# Altium schematic sheet STlink_V3E_Module.SchDoc: ST-LINK/V3E-SWD Module
size A4; Date: Not used; ApprovedBy: Not used; CheckedBy: Not used; Author: Not used; CompanyName: STMicroelectronics; DrawnBy: Not used; Engineer: Not used; Organization: Not used; Address1: Not used; Address2: Not used; Address3: Not used; Address4: Not used; DocumentNumber: Not used; Revision: Not used; SheetNumber: 17; SheetTotal: 19; CurrentTime: Not used; CurrentDate: Not used; Time: Not used; DocumentFullPathAndName: Not used; DocumentName: Not used; ModifiedDate: Not used; ImagePath: Not used; ProjectName: Not used; Application_BuildNumber: Not used
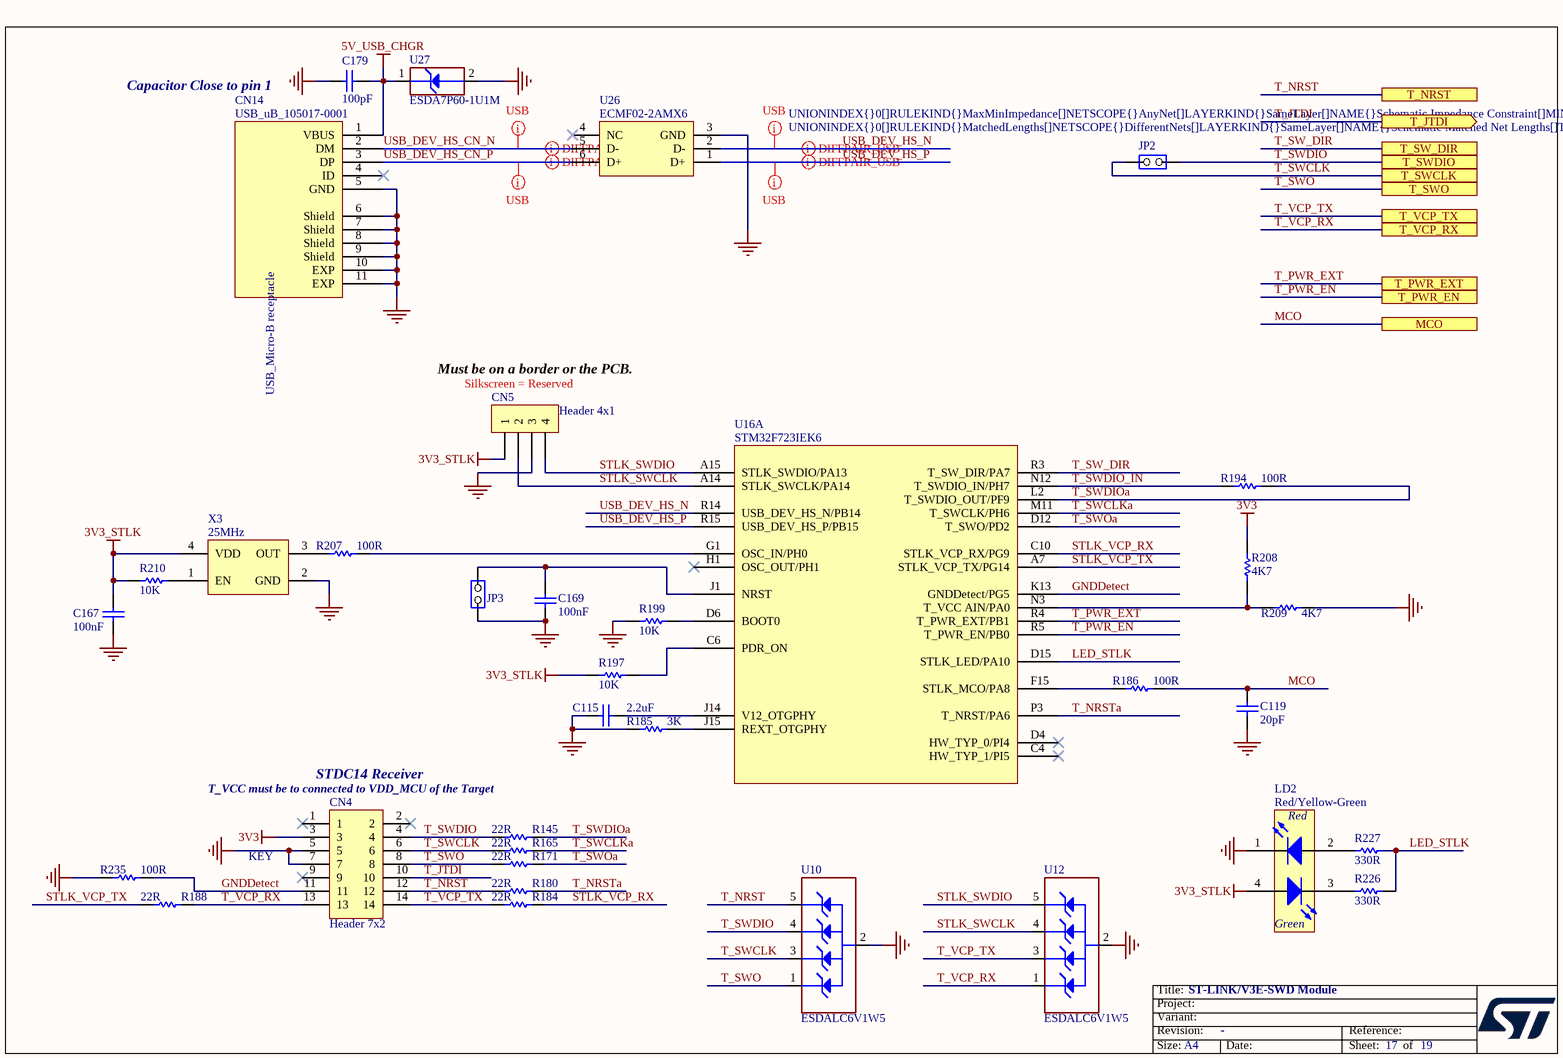
[diagram p0: STlink_V3E_Module.SchDoc]

## Parts
C115  value 2.2uF  [C0603]  (hidden comment: Capacitor)
C119  value 20pF  [C0402]  (hidden comment: Capacitor)
C167  value 100nF  [C0402]  (hidden comment: Capacitor)
C169  value 100nF  [C0402]  (hidden comment: Capacitor)
C179  value 100pF  [C0402]  (hidden comment: Capacitor)
CN4  Header 7x2  [CON_STDC14_Receiver_MEDIUM]
CN5  Header 4x1  [CON_SAMTEC_TSW-104-07-G-S]
CN14  value USB_uB_105017-0001  [CON_USBMICROB_MOLEX_105017-0001_H2P90]  (hidden comment: USB_uB_105017.0001)
JP2  Jumper Header 2x1  [CON_SAMTEC_TSW-102-07-G-S]  (value not drawn)
JP3  Jumper Header 2x1  [CON_SAMTEC_TSW-102-07-G-S]  (value not drawn)
LD2  value Red/Yellow-Green  [LED_BI-GR_HSMF-A201-A00J1]  (hidden comment: LD_BICOLOR_CMS)
R145  value 22R  [R0402]  (hidden comment: Resistor)
R165  value 22R  [R0402]  (hidden comment: Resistor)
R171  value 22R  [R0402]  (hidden comment: Resistor)
R180  value 22R  [R0402]  (hidden comment: Resistor)
R184  value 22R  [R0402]  (hidden comment: Resistor)
R185  value 3K  [R0402]  (hidden comment: Resistor)
R186  value 100R  [R0402]  (hidden comment: Resistor)
R188  value 22R  [R0402]  (hidden comment: Resistor)
R194  value 100R  [R0402]  (hidden comment: Resistor)
R197  value 10K  [R0402]  (hidden comment: Resistor)
R199  value 10K  [R0402]  (hidden comment: Resistor)
R207  value 100R  [R0402]  (hidden comment: Resistor)
R208  value 4K7  [R0402]  (hidden comment: Resistor)
R209  value 4K7  [R0402]  (hidden comment: Resistor)
R210  value 10K  [R0402]  (hidden comment: Resistor)
R226  value 330R  [R0603]  (hidden comment: Resistor)
R227  value 330R  [R0603]  (hidden comment: Resistor)
R235  value 100R  [R0402]  (hidden comment: Resistor)
U10  ESDALC6V1W5  [ESD_SOT323-5L]
U12  ESDALC6V1W5  [ESD_SOT323-5L]
U16  value STM32F723IEK6  [ICC_UFBGA201_176+25_10X10_P065]  (hidden comment: ST-LINKV3E_SWD)  (part A of 2)
U26  value ECMF02-2AMX6  [ESD_QFN-6L_1P7X1P5_P050]  (hidden comment: ​)
U27  ESDA7P60-1U1M  [ESD_QFN2_1P6X1_P125]
X3  value 25MHz  [OSC_NDK_NZ2520SB_4P]  (hidden comment: Oscillator_4pins)

## Ports
MCO, T_JTDI (out), T_NRST, T_PWR_EN, T_PWR_EXT, T_SW_DIR, T_SWCLK, T_SWDIO, T_SWO, T_VCP_RX, T_VCP_TX

## Nets
3V3: CN4.3 R208.2
3V3_STLK: C167.2 CN5.1 LD2.4(YellowGreen_anode) R197.1 R210.1 X3.4(VDD)
5V_USB_CHGR: C179.2 CN14.1(VBUS) U27.1(IO1)
GND: C115.1 C119.1 C167.1 C169.1 C179.1 CN4.5 CN4.7 CN5.3 CN14.5(GND) CN14.6(Shield) CN14.7(Shield) CN14.8(Shield) CN14.9(Shield) CN14.10(EXP) CN14.11(EXP) JP3.1(COMMON) LD2.1(RED_cathode) R185.1 R199.1 R209.2 R235.1 U10.2(GND) U12.2(GND) U26.3(GND) U27.2(GND) X3.2(GND)
GNDDetect: CN4.11 R235.2 U16.K13(GNDDetect/PG5)
LED_STLK: R226.2 R227.2 U16.D15(STLK_LED/PA10)
MCO: C119.2 R186.2 ; port MCO
STLK_SWCLK: CN5.2 U12.4(IO3) U16.A14(STLK_SWCLK/PA14)
STLK_SWDIO: CN5.4 U12.5(IO4) U16.A15(STLK_SWDIO/PA13)
STLK_VCP_RX: R184.2 U16.C10(STLK_VCP_RX/PG9)
STLK_VCP_TX: R188.1 U16.A7(STLK_VCP_TX/PG14)
T_JTDI: CN4.10 ; port T_JTDI
T_NRST: CN4.12 R180.1 U10.5(IO4) ; port T_NRST
T_NRSTa: R180.2 U16.P3(T_NRST/PA6)
T_PWR_EN: U16.R5(T_PWR_EN/PB0) ; port T_PWR_EN
T_PWR_EXT: U16.R4(T_PWR_EXT/PB1) ; port T_PWR_EXT
T_SW_DIR: U16.R3(T_SW_DIR/PA7) ; port T_SW_DIR
T_SWCLK: CN4.6 JP2.1(COMMON) R165.1 U10.3(IO2) ; port T_SWCLK
T_SWCLKa: R165.2 U16.M11(T_SWCLK/PH6)
T_SWDIO: CN4.4 JP2.2(NO) R145.1 U10.4(IO3) ; port T_SWDIO
T_SWDIO_IN: R194.1 U16.N12(T_SWDIO_IN/PH7)
T_SWDIOa: R145.2 R194.2 U16.L2(T_SWDIO_OUT/PF9)
T_SWO: CN4.8 R171.1 U10.1(IO1) ; port T_SWO
T_SWOa: R171.2 U16.D12(T_SWO/PD2)
T_VCP_RX: CN4.13 R188.2 U12.1(IO1) ; port T_VCP_RX
T_VCP_TX: CN4.14 R184.1 U12.3(IO2) ; port T_VCP_TX
USB_DEV_HS_CN_N: CN14.2(DM) U26.5(D-)
USB_DEV_HS_CN_P: CN14.3(DP) U26.6(D+)
USB_DEV_HS_N: U16.R14(USB_DEV_HS_N/PB14) U26.2(D-)
USB_DEV_HS_P: U16.R15(USB_DEV_HS_P/PB15) U26.1(D+)
NetC115_2: C115.2 U16.J14(V12_OTGPHY)
NetC169_2: C169.2 JP3.2(NO) U16.J1(NRST)
NetLD2_2: LD2.2(Red_anode) R227.1
NetLD2_3: LD2.3(YellowGreen_cathode) R226.1
NetR185_2: R185.2 U16.J15(REXT_OTGPHY)
NetR186_1: R186.1 U16.F15(STLK_MCO/PA8)
NetR197_2: R197.2 U16.C6(PDR_ON)
NetR199_2: R199.2 U16.D6(BOOT0)
NetR207_1: R207.1 X3.3(OUT)
NetR207_2: R207.2 U16.G1(OSC_IN/PH0)
NetR208_1: R208.1 R209.1 U16.N3(T_VCC_AIN/PA0)
NetR210_2: R210.2 X3.1(EN)

Not connected (* = marked no-connect by the designer): CN4 1* 2* 9*; CN14 4(ID)*; U16 C4(HW_TYP_1/PI5)* D4(HW_TYP_0/PI4)* H1(OSC_OUT/PH1)*; U26 4(NC)*

## Layout directives
differential pair; rule Impedance Constraint [Min = 85.00    Max = 95.00    ]: USB_DEV_HS_CN_N, USB_DEV_HS_CN_P, USB_DEV_HS_N, USB_DEV_HS_P
rule Undefined; rule Matched Net Lengths [Tolerance = 0.2mm]; rule Impedance Constraint [Min = 85.00    Max = 95.00    ]: USB_DEV_HS_CN_N, USB_DEV_HS_CN_P, USB_DEV_HS_N, USB_DEV_HS_P

## Notes on the sheet
- Capacitor Close to pin 1
- Must be on a border or the PCB.
- (near CN5) Silkscreen = Reserved
- T_VCC must be to connected to VDD_MCU of the Target
- (near CN4) STDC14 Receiver
- KEY
- Title:
- Project:
- Size:
- Revision:
- Variant:
- A4
- -
- Date:
- Reference:
- Sheet:
- of
- (in symbol MCD-00028) USB_Micro-B receptacle
- (in symbol MCD-02402) Red; Green

## Library data of the parts
C115 = MCD-00012: Capacitor, MLCC, 2.2uF, 10V, X5R, 10%, 0603, T=0,8mm; Manufacturer_Part_Number: CC0603KRX5R6BB225; Manufacturer: YAGEO; Alternate_Manufacturer_Part_Number: C0603C225K8PACTU; Alternate_Manufacturer: KEMET; BMS_Part_Number: 9142010; Part_Preference: Recommended; Partial_Alternate_Internal_Part_Number: MCD-00551; Provided_By: Subcon; Initial_Board_Reference: mb1274; Component_Country_Of_Origin: China; ID: 2467; Order_Code_RS: 2370679; ShowFields: YES; Internal_Part_Number: MCD-00012; Status: Released; Package: 0603; ComponentLink1Description: Yageo_Capacitor_X5R-series.pdf; ECCN_US: n/a; ECCN_EU: n/a; Part_Type: Capacitor; ComponentLink1URL: http://tunmcdsvn.tun.st.com/Component_Documentation_Library/Trunk/Capacitor/YAGEO_X5R_Series; Order_Code_Digikey: 311-1451-1-ND; Order_Code_Farnell: 2370679
C119 = MCD-00016: Capacitor, MLCC, 20pF, 50V, NPO, 5%, 0402, T=0,5mm; Manufacturer_Part_Number: CC0402JRNPO9BN200; Manufacturer: YAGEO; Part_Preference: Recommended; Provided_By: Subcon; Initial_Board_Reference: mb1274; Component_Country_Of_Origin: China; ID: 2479; ShowFields: YES; Internal_Part_Number: MCD-00016; Status: Released; Package: 0402; ComponentLink1Description: Yageo_Capacitor_NP0_16V-to-50V.pdf; ECCN_US: n/a; ECCN_EU: n/a; Part_Type: Capacitor; ComponentLink1URL: http://tunmcdsvn.tun.st.com/Component_Documentation_Library/Trunk/Capacitor/YAGEO_NP0_Series; Order_Code_Digikey: 311-1417-1-ND; Order_Code_Farnell: N/A; Order_Code_RS: N/A
C167 C169 = MCD-00006: Capacitor, MLCC, 100nF, 16V, X7R, +/-10%, 0402, T=0.5mm; Manufacturer_Part_Number: CC0402KRX7R7BB104; Manufacturer: YAGEO; Part_Preference: Recommended; Partial_Alternate_Internal_Part_Number: MCD-03299; Component_Country_Of_Origin: China; ID: 2474; Order_Code_RS: 9402047; ShowFields: YES; Internal_Part_Number: MCD-00006; Status: Released; Package: 0402; Part_Type: Capacitor; ComponentLink1URL: http://tunmcdsvn.tun.st.com/Component_Documentation_Library/Trunk/Capacitor/YAGEO_X7R_Series; Order_Code_Digikey: 311-1338-1-ND; Order_Code_Farnell: 9402047
C179 = MCD-00205: Capacitor, MLCC, 100pF, 50V, NPO, 5%, 0402, T=0,5mm; Manufacturer_Part_Number: CC0402JRNPO9BN101; Manufacturer: YAGEO; Part_Preference: Recommended; Provided_By: Subcon; Component_Country_Of_Origin: China; ID: 2658; ShowFields: YES; Internal_Part_Number: MCD-00205; Status: Released; Part_Type: Capacitor; Package: 0402; ComponentLink1Description: Yageo_Capacitor_NP0_16V-to-50V.pdf; ComponentLink1URL: http://tunmcdsvn.tun.st.com/Component_Documentation_Library/Trunk/Capacitor/YAGEO_NP0_Series; Order_Code_Digikey: 311-1024-1-ND; Order_Code_Farnell: 3019226RL; Order_Code_RS: N/A
CN4 = MCD-00592: Header, 7x2, 1.27mm, VR, SMD, T=5.97mm; Part_Type: Connector; Manufacturer_Part_Number: FTSH-107-01-L-DV-K; Manufacturer: SAMTEC; Part_Preference: Recommended; Component_Country_Of_Origin: China, Costa Rica, Malaysia, USA, Vietnam; ID: 3151; Order_Code_RS: 179-9021; ShowFields: YES; Internal_Part_Number: MCD-00592; Value: Header 7x2; Status: Released; ComponentLink1URL: http://tunmcdsvn.tun.st.com/Component_Documentation_Library/Trunk/Connector/SAMTEC_FTSH_Series/; Order_Code_Digikey: SAM9449-ND; Order_Code_Farnell: 2856443
CN5 = MCD-00029: Header, 4x1, 2,54mm, VR, TH, Height 5.84mm/2.54mm; Manufacturer_Part_Number: TSW-104-07-G-S; Manufacturer: SAMTEC; Part_Type: Connector; Part_Preference: Recommended; Provided_By: Subcon; Initial_Board_Reference: mb1274; Component_Country_Of_Origin: China, Costa Rica, Malaysia, USA, Vietnam; ID: 2487; Order_Code_RS: 161-2460; ShowFields: YES; Internal_Part_Number: MCD-00029; Value: Header 4x1; Status: Released; ComponentLink1Description: Samtec_connector_TSW-HTSW-series.pdf; ECCN_US: n/a; ECCN_EU: n/a; ComponentLink1URL: http://tunmcdsvn.tun.st.com/Component_Documentation_Library/Trunk/Connector/SAMTEC_TSW_Series; Order_Code_Digikey: TSW-104-07-G-S-ND; Order_Code_Farnell: 2667450
CN14 = MCD-00028: USB-MICRO-B, 0.65mm, RA, SMT, Bottom Mount,; Manufacturer_Part_Number: 1050170001; Manufacturer: MOLEX; Part_Type: Connector; Part_Preference: Recommended; Provided_By: Subcon; Initial_Board_Reference: mb1274; Component_Country_Of_Origin: Unknown; ID: 2489; Order_Code_RS: 2293836; ShowFields: YES; Internal_Part_Number: MCD-00028; Status: Released; ComponentLink1Description: Molex_Connector-USB-microB_105017-0001.pdf; ECCN_US: n/a; ECCN_EU: n/a; ComponentLink1URL: http://tunmcdsvn.tun.st.com/Component_Documentation_Library/Trunk/Connector/MOLEX_1050170001; Order_Code_Digikey: WM1399TR-ND; Order_Code_Farnell: 2293836
JP2 JP3 = MCD-00045: Header, 2x1, 2,54mm, VR, TH, Height 5.84mm/2.54mm; Manufacturer_Part_Number: TSW-102-07-G-S; Manufacturer: SAMTEC; Part_Type: Connector; Full_Alternate_Internal_Part_Number: MCD-02390; Part_Preference: Recommended; Partial_Alternate_Internal_Part_Number: MCD-02957, MCD-03720, MCD-04249; Provided_By: Subcon; Initial_Board_Reference: mb1274; Component_Country_Of_Origin: China, Costa Rica, Malaysia, USA, Vietnam; ID: 2545; Order_Code_RS: 2505044; ShowFields: YES; Internal_Part_Number: MCD-00045; Value: Header 2x1; Status: Released; ComponentLink1Description: Samtec_connector_TSW-HTSW-series.pdf; ECCN_US: n/a; ECCN_EU: n/a; ComponentLink1URL: http://tunmcdsvn.tun.st.com/Component_Documentation_Library/Trunk/Connector/SAMTEC_TSW_Series/; Order_Code_Digikey: SAM1029-02-ND; Order_Code_Farnell: 2505044
LD2 = MCD-02402: LED Bicolor, Red/Yellow-Green , 2V, 20mA, 4-PLCC; Part_Type: Display; Manufacturer_Part_Number: 67-22SURSYGC/S530-A2/TR8; Manufacturer: EVERLIGHT; Full_Alternate_Internal_Part_Number: MCD-00051, MCD-02631; Part_Preference: Not recommended; ID: 4508; ShowFields: YES; Internal_Part_Number: MCD-02402; Status: Checked; ComponentLink1URL: http://tunmcdsvn.tun.st.com/Component_Documentation_Library/Trunk/Display/EVERLIGHT_67-22SURSYGC-S530-A2-TR8; Order_Code_Digikey: 1080-67-22SURSYGC/S530-A2/TR8TR-ND; Order_Code_Farnell: N/A; Order_Code_RS: N/A; Package: 4-PLCC
R145 R165 R171 R180 R184 R188 = MCD-00189: Resistor,22R,0402,1%,1/16W; Manufacturer_Part_Number: RC0402FR-0722RL; Manufacturer: YAGEO; Part_Preference: Recommended; Provided_By: Subcon; Component_Country_Of_Origin: China; ID: 2677; ShowFields: YES; Internal_Part_Number: MCD-00189; Status: Released; Part_Type: Resistor; ComponentLink1Description: Yageo_Resistor_RC0402-series.pdf; ECCN_US: n/a; ECCN_EU: n/a; Package: 0402; ComponentLink1URL: http://tunmcdsvn.tun.st.com/Component_Documentation_Library/Trunk/Resistor/YAGEO_RC_L_Series; Order_Code_Digikey: 311-22.0LRCT-ND; Order_Code_Farnell: 9239030; Order_Code_RS: N/A
R185 = MCD-00185: Resistor,3K,0402,1%,1/16W; Manufacturer_Part_Number: RC0402FR-073KL; Manufacturer: YAGEO; Part_Preference: Recommended; Provided_By: Subcon; Component_Country_Of_Origin: China; ID: 2682; ShowFields: YES; Internal_Part_Number: MCD-00185; Status: Released; ComponentLink1Description: Yageo_Resistor_RC0402-series.pdf; ECCN_US: n/a; ECCN_EU: n/a; Part_Type: Resistor; Package: 0402; ComponentLink1URL: http://tunmcdsvn.tun.st.com/Component_Documentation_Library/Trunk/Resistor/YAGEO_RC_L_Series; Order_Code_Digikey: 311-3KLRCT-ND; Order_Code_Farnell: 1458777; Order_Code_RS: N/A
R186 R194 R207 R235 = MCD-00067: Resistor, 100R, 0402, +/- 1%, 1/16W; Manufacturer_Part_Number: RC0402FR-07100RL; Manufacturer: YAGEO; Part_Preference: Recommended; Component_Country_Of_Origin: China; ID: 2527; Order_Code_RS: 9239111; ShowFields: YES; Internal_Part_Number: MCD-00067; Status: Released; Part_Type: Resistor; Package: 0402; ComponentLink1URL: http://tunmcdsvn.tun.st.com/Component_Documentation_Library/Trunk/Resistor/YAGEO_RC_L_Series; Order_Code_Digikey: 311-100LRCT-ND; Order_Code_Farnell: 9239111
R197 R199 R210 = MCD-00053: Resistor,10K,0402,1%,1/16W; Manufacturer_Part_Number: RC0402FR-0710KL; Manufacturer: YAGEO; BMS_Part_Number: 9131590; Part_Preference: Recommended; Provided_By: subcon; Initial_Board_Reference: mb1274; Component_Country_Of_Origin: China; ID: 2539; Order_Code_RS: 9239359; ShowFields: YES; Internal_Part_Number: MCD-00053; Status: Released; ComponentLink1Description: Yageo_Resistor_RC0402-series.pdf; ECCN_US: n/a; ECCN_EU: n/a; Part_Type: Resistor; Package: 0402; ComponentLink1URL: http://tunmcdsvn.tun.st.com/Component_Documentation_Library/Trunk/Resistor/YAGEO_RC_L_Series; Order_Code_Digikey: 311-10.0KLRCT-ND; Order_Code_Farnell: 9239359
R208 R209 = MCD-00065: Resistor,4K7,0402,1%,1/16W; Manufacturer_Part_Number: RC0402FR-074K7L; Manufacturer: YAGEO; Alternate_Manufacturer_Part_Number: RT0402FRE074K7L; Part_Preference: Recommended; Partial_Alternate_Internal_Part_Number: MCD-03300; Provided_By: Subcon; Initial_Board_Reference: mb1274; Component_Country_Of_Origin: China; ID: 2526; Order_Code_RS: 9239316; ShowFields: YES; Internal_Part_Number: MCD-00065; Status: Released; ComponentLink1Description: Yageo_Resistor_RC0402-series.pdf; ECCN_US: n/a; ECCN_EU: n/a; Alternate_Manufacturer: YAGEO; Part_Type: Resistor; Package: 0402; ComponentLink1URL: http://tunmcdsvn.tun.st.com/Component_Documentation_Library/Trunk/Resistor/YAGEO_RC_L_Series; Order_Code_Digikey: 311-4.7KLRCT-ND; Order_Code_Farnell: 9239316
R226 R227 = MCD-00197: Resistor,330R,0603,1%,1/10W; Manufacturer_Part_Number: RC0603FR-07330RL; Manufacturer: YAGEO; BMS_Part_Number: 9129729; Part_Preference: Recommended; Provided_By: Subcon; Component_Country_Of_Origin: China; ID: 2672; ShowFields: YES; Internal_Part_Number: MCD-00197; Status: Released; ComponentLink1Description: Yageo_Resistor_RC0603-series.pdf; ECCN_US: n/a; ECCN_EU: n/a; Part_Type: Resistor; Package: 0603; ComponentLink1URL: http://tunmcdsvn.tun.st.com/Component_Documentation_Library/Trunk/Resistor/YAGEO_RC_L_Series; Order_Code_Digikey: 311-330HRCT-ND; Order_Code_Farnell: 9238425; Order_Code_RS: N/A
U10 U12 = MCD-00136: Dual Transil array for ESD protection; Part_Type: Diode; Manufacturer: STMICROELECTRONICS; BMS_Part_Number: 9151112; Manufacturer_HQ_COO: EU; Part_Preference: Recommended; ECCN_US: EAR99; ECCN_EU: NEC; Provided_By: Subcon; Initial_Board_Reference: mb1262; Component_Country_Of_Origin: China; ID: 2731; Order_Code_RS: 178-7373; ShowFields: YES; Internal_Part_Number: MCD-00136; Value: ESDALC6V1W5; Status: Released; Manufacturer_Part_Number: ESDALC6V1W5; ComponentLink1Description: STM_ESD_ESDALC6V1W5.pdf; ComponentLink1URL: http://tunmcdsvn.tun.st.com/Component_Documentation_Library/Trunk/Diode/STMICROELECTRONICS_ESDALC6V1W5; Order_Code_Digikey: 497-7231-2-ND; Order_Code_Farnell: 2252381; Package: SOT323-5
U16 = MCD-00596: STM32F723IEK  (STM32F7) BGA176; Part_Type: IC; Manufacturer: STMICROELECTRONICS; BMS_Part_Number: 9175300; Manufacturer_HQ_COO: EU; Part_Preference: Not recommended; Provided_By: SUBCO with ST control; Initial_Board_Reference: MB1331; Item Type: Item; Path: ws/MCD_ApplicationBoards/Lists/MCDPARTSdatabase; Component_Country_Of_Origin: Philippines; ID: 3144; Order_Code_RS: 135-8241; ShowFields: YES; Internal_Part_Number: MCD-00596; Status: Released; Manufacturer_Part_Number: STM32F723IEK6; ComponentLink1Description: Datasheet; ComponentLink1URL: http://tunmcdsvn.tun.st.com/Component_Documentation_Library/Trunk/IC/STMICROELECTRONICS_STM32F723IEK6; Order_Code_Digikey: 497-17186-ND; Order_Code_Farnell: 2725149; Package: UFBGA-201
U26 = MCD-00649: Common mode filter with ESD protection for USB 2.0 interface; Part_Type: Diode; Manufacturer: STMICROELECTRONICS; BMS_Part_Number: 9151138; Manufacturer_HQ_COO: EU; Part_Preference: Recommended; ECCN_US: EAR99; ECCN_EU: NEC; Provided_By: Subcon; Initial_Board_Reference: MB1248; Component_Country_Of_Origin: China; ID: 3094; Order_Code_RS: 880-5276; ShowFields: YES; Internal_Part_Number: MCD-00649; Status: Released; Manufacturer_Part_Number: ECMF02-2AMX6; ComponentLink1Description: STM_ESD_ECMF02-2AMX6.pdf; ComponentLink1URL: http://tunmcdsvn.tun.st.com/Component_Documentation_Library/Trunk/Diode/STMICROELECTRONICS_ECMF02-2AMX6; Order_Code_Digikey: 497-10773-2-ND; Order_Code_Farnell: 2629720; Package: QFN-6
U27 = MCD-00251: High power transient voltage suppressor, 7V breakdown; Part_Type: Diode; Manufacturer: STMICROELECTRONICS; BMS_Part_Number: 9179042; Manufacturer_HQ_COO: EU; Part_Preference: Recommended; ECCN_US: EAR99; ECCN_EU: NEC; Provided_By: Subcon; Initial_Board_Reference: MB1311; Component_Country_Of_Origin: China; ID: 2618; Order_Code_RS: 110-6381; ShowFields: YES; Internal_Part_Number: MCD-00251; Value: ESDA7P60-1U1M; Status: Released; Manufacturer_Part_Number: ESDA7P60-1U1M; ComponentLink1Description: STM_ESD_ESDA7P60-1U1M.pdf; ComponentLink1URL: http://tunmcdsvn.tun.st.com/Component_Documentation_Library/Trunk/Diode/STMICROELECTRONICS_ESDA7P60-1U1M; Order_Code_Digikey: 497-16253-2-ND; Order_Code_Farnell: N/A; Package: QFN1610
X3 = MCD-00597: Oscillator 25.00Mhz, -+50PPM, 3.3V, Temp -55 to +125°C; Part_Type: Crystal_Osc; Manufacturer_Part_Number: NZ2520SH-25MHZ-END4869C; Manufacturer: NDK; Alternate_Manufacturer_Part_Number: KC2520B25.0000C10E00; Alternate_Manufacturer: AVX CORP/KYOCERA CORP; BMS_Part_Number: 9157050; Part_Preference: Recommended; Provided_By: STM; Initial_Board_Reference: MB1331; Component_Country_Of_Origin: Unknown; ID: 3148; ShowFields: YES; Internal_Part_Number: MCD-00597; Status: Released; ComponentLink1Description: NDK_OSCILLATOR_NZ2520SB.pdf; ComponentLink1URL: http://tunmcdsvn.tun.st.com/Component_Documentation_Library/Trunk/Crystal_Oscillator/NDK_NZ2520SH_Series; Order_Code_Digikey: N/A; ECCN_US: n/a; ECCN_EU: n/a; Order_Code_Farnell: N/A; Order_Code_RS: N/A; Package: 2.5x2.0mm